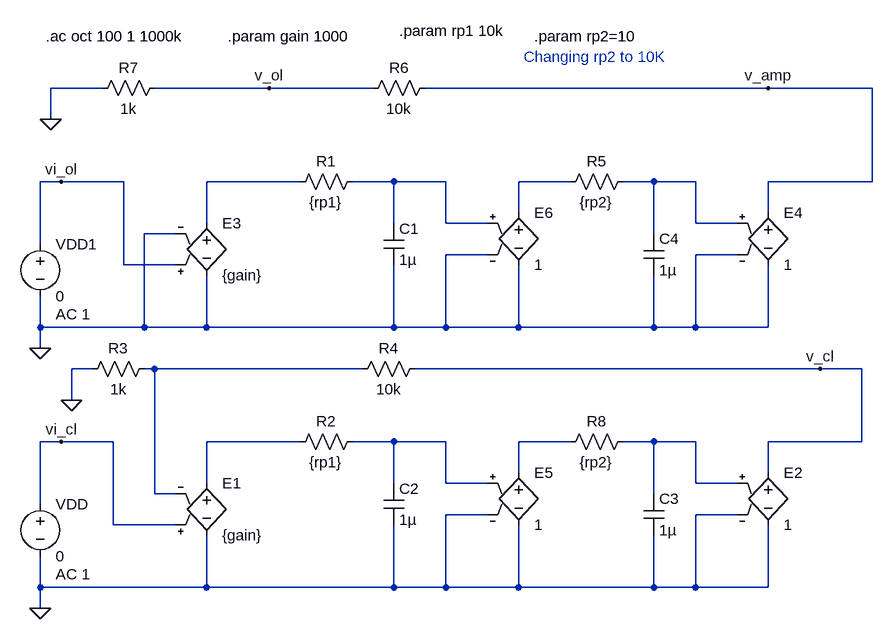
[diagram p0: schematic 2nd_order.asc]
2nd_order.asc, the LTspice schematic file:
Version 4
SHEET 1 1092 932
WIRE -928 -560 -1008 -560
WIRE -672 -560 -848 -560
WIRE -512 -560 -672 -560
WIRE 96 -560 -432 -560
WIRE 256 -560 96 -560
WIRE -1008 -512 -1008 -560
WIRE -992 -416 -1024 -416
WIRE -896 -416 -992 -416
WIRE -624 -416 -768 -416
WIRE -480 -416 -544 -416
WIRE -400 -416 -480 -416
WIRE -208 -416 -288 -416
WIRE -80 -416 -128 -416
WIRE -16 -416 -80 -416
WIRE 256 -416 256 -560
WIRE 256 -416 96 -416
WIRE -288 -368 -288 -416
WIRE 96 -368 96 -416
WIRE -768 -352 -768 -416
WIRE -480 -352 -480 -416
WIRE -400 -352 -400 -416
WIRE -336 -352 -400 -352
WIRE -16 -352 -16 -416
WIRE 48 -352 -16 -352
WIRE -816 -336 -864 -336
WIRE -80 -336 -80 -416
WIRE -1024 -320 -1024 -416
WIRE -336 -304 -400 -304
WIRE 48 -304 -16 -304
WIRE -896 -288 -896 -416
WIRE -816 -288 -896 -288
WIRE -1024 -192 -1024 -240
WIRE -864 -192 -864 -336
WIRE -864 -192 -1024 -192
WIRE -768 -192 -768 -272
WIRE -768 -192 -864 -192
WIRE -480 -192 -480 -288
WIRE -480 -192 -768 -192
WIRE -400 -192 -400 -304
WIRE -400 -192 -480 -192
WIRE -288 -192 -288 -288
WIRE -288 -192 -400 -192
WIRE -80 -192 -80 -272
WIRE -80 -192 -288 -192
WIRE -16 -192 -16 -304
WIRE -16 -192 -80 -192
WIRE 96 -192 96 -288
WIRE 96 -192 -16 -192
WIRE -1024 -160 -1024 -192
WIRE -944 -128 -976 -128
WIRE -848 -128 -864 -128
WIRE -528 -128 -848 -128
WIRE 176 -128 -448 -128
WIRE 240 -128 176 -128
WIRE -976 -80 -976 -128
WIRE -992 -16 -1024 -16
WIRE -912 -16 -992 -16
WIRE -624 -16 -768 -16
WIRE -480 -16 -544 -16
WIRE -400 -16 -480 -16
WIRE -208 -16 -288 -16
WIRE -80 -16 -128 -16
WIRE -16 -16 -80 -16
WIRE 240 -16 240 -128
WIRE 240 -16 96 -16
WIRE -288 32 -288 -16
WIRE 96 32 96 -16
WIRE -768 48 -768 -16
WIRE -480 48 -480 -16
WIRE -400 48 -400 -16
WIRE -336 48 -400 48
WIRE -16 48 -16 -16
WIRE 48 48 -16 48
WIRE -848 64 -848 -128
WIRE -816 64 -848 64
WIRE -80 64 -80 -16
WIRE -1024 80 -1024 -16
WIRE -336 96 -400 96
WIRE 48 96 -16 96
WIRE -912 112 -912 -16
WIRE -816 112 -912 112
WIRE -1024 208 -1024 160
WIRE -768 208 -768 128
WIRE -768 208 -1024 208
WIRE -480 208 -480 112
WIRE -480 208 -768 208
WIRE -400 208 -400 96
WIRE -400 208 -480 208
WIRE -288 208 -288 112
WIRE -288 208 -400 208
WIRE -80 208 -80 128
WIRE -80 208 -288 208
WIRE -16 208 -16 96
WIRE -16 208 -80 208
WIRE 96 208 96 112
WIRE 96 208 -16 208
WIRE -1024 240 -1024 208
FLAG -1024 240 0
FLAG -992 -16 vi_cl
FLAG -1024 -160 0
FLAG -992 -416 vi_ol
FLAG -1008 -512 0
FLAG -672 -560 v_ol
FLAG 96 -560 v_amp
FLAG 176 -128 v_cl
FLAG -976 -80 0
SYMBOL voltage -1024 64 R0
WINDOW 123 24 124 Left 2
WINDOW 39 0 0 Left 2
SYMATTR Value2 AC 1
SYMATTR InstName VDD
SYMATTR Value 0
SYMBOL res -528 -32 R90
WINDOW 0 0 56 VBottom 2
WINDOW 3 32 56 VTop 2
SYMATTR InstName R2
SYMATTR Value {rp1}
SYMBOL cap -496 48 R0
SYMATTR InstName C2
SYMATTR Value 1µ
SYMBOL e2 -768 32 R0
SYMATTR InstName E1
SYMATTR Value {gain}
SYMBOL res -848 -144 R90
WINDOW 0 0 56 VBottom 2
WINDOW 3 32 56 VTop 2
SYMATTR InstName R3
SYMATTR Value 1k
SYMBOL res -432 -144 R90
WINDOW 0 0 56 VBottom 2
WINDOW 3 32 56 VTop 2
SYMATTR InstName R4
SYMATTR Value 10k
SYMBOL e 96 16 R0
SYMATTR InstName E2
SYMATTR Value 1
SYMBOL voltage -1024 -336 R0
WINDOW 123 24 124 Left 2
WINDOW 39 0 0 Left 2
SYMATTR Value2 AC 1
SYMATTR InstName VDD1
SYMATTR Value 0
SYMBOL res -528 -432 R90
WINDOW 0 0 56 VBottom 2
WINDOW 3 32 56 VTop 2
SYMATTR InstName R1
SYMATTR Value {rp1}
SYMBOL cap -496 -352 R0
SYMATTR InstName C1
SYMATTR Value 1µ
SYMBOL e2 -768 -368 R0
SYMATTR InstName E3
SYMATTR Value {gain}
SYMBOL e 96 -384 R0
SYMATTR InstName E4
SYMATTR Value 1
SYMBOL res -416 -576 R90
WINDOW 0 0 56 VBottom 2
WINDOW 3 32 56 VTop 2
SYMATTR InstName R6
SYMATTR Value 10k
SYMBOL res -832 -576 R90
WINDOW 0 0 56 VBottom 2
WINDOW 3 32 56 VTop 2
SYMATTR InstName R7
SYMATTR Value 1k
SYMBOL e -288 16 R0
SYMATTR InstName E5
SYMATTR Value 1
SYMBOL e -288 -384 R0
SYMATTR InstName E6
SYMATTR Value 1
SYMBOL res -112 -432 R90
WINDOW 0 0 56 VBottom 2
WINDOW 3 32 56 VTop 2
SYMATTR InstName R5
SYMATTR Value {rp2}
SYMBOL res -112 -32 R90
WINDOW 0 0 56 VBottom 2
WINDOW 3 32 56 VTop 2
SYMATTR InstName R8
SYMATTR Value {rp2}
SYMBOL cap -96 64 R0
SYMATTR InstName C3
SYMATTR Value 1µ
SYMBOL cap -96 -336 R0
SYMATTR InstName C4
SYMATTR Value 1µ
TEXT -1016 -640 Left 2 !.ac oct 100 1 1000k
TEXT -736 -640 Left 2 !.param gain 1000
TEXT -472 -648 Left 2 !.param rp1 10k
TEXT -264 -640 Left 2 !.param rp2=10
TEXT -280 -608 Left 2 ;Changing rp2 to 10K

The netlist it stands for:
* 2nd_order.asc
VDD vi_cl 0 0 AC 1
R2 N007 N006 {rp1}
C2 N007 0 1µ
E1 N006 0 vi_cl N005 {gain}
R3 N005 0 1k
R4 v_cl N005 10k
E2 v_cl 0 N009 0 1
VDD1 vi_ol 0 0 AC 1
R1 N002 N001 {rp1}
C1 N002 0 1µ
E3 N001 0 vi_ol 0 {gain}
E4 v_amp 0 N004 0 1
R6 v_amp v_ol 10k
R7 v_ol 0 1k
E5 N008 0 N007 0 1
E6 N003 0 N002 0 1
R5 N004 N003 {rp2}
R8 N009 N008 {rp2}
C3 N009 0 1µ
C4 N004 0 1µ
.ac oct 100 1 1000k
.param gain 1000
.param rp1 10k
.param rp2=10
* Changing rp2 to 10K
.backanno
.end

* Results of the author's LTspice run, read from the files saved beside the schematic
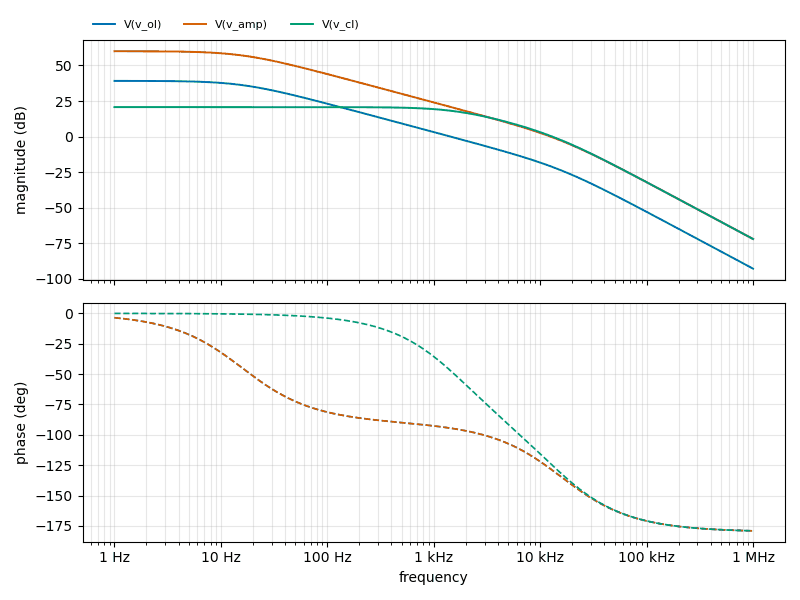
[diagram p1: AC Analysis of 2nd_order.asc, plotted from the saved traces]
* AC Analysis, 1 run:
*   V(v_ol): 39.16 dB at 1 Hz, -92.76 dB at 1 MHz, peak 39.16 dB at 1 Hz, 3 dB below the peak at 15.98 Hz
*   V(v_amp): 59.98 dB at 1 Hz, -71.93 dB at 1 MHz, peak 59.98 dB at 1 Hz, 3 dB below the peak at 15.98 Hz
*   V(v_cl): 20.73 dB at 1 Hz, -71.93 dB at 1 MHz, peak 20.73 dB at 1 Hz, 3 dB below the peak at 1.607 kHz